# EAGLE schematic rgb circle (EAGLE 5.11)

## Sheet 1 of 2
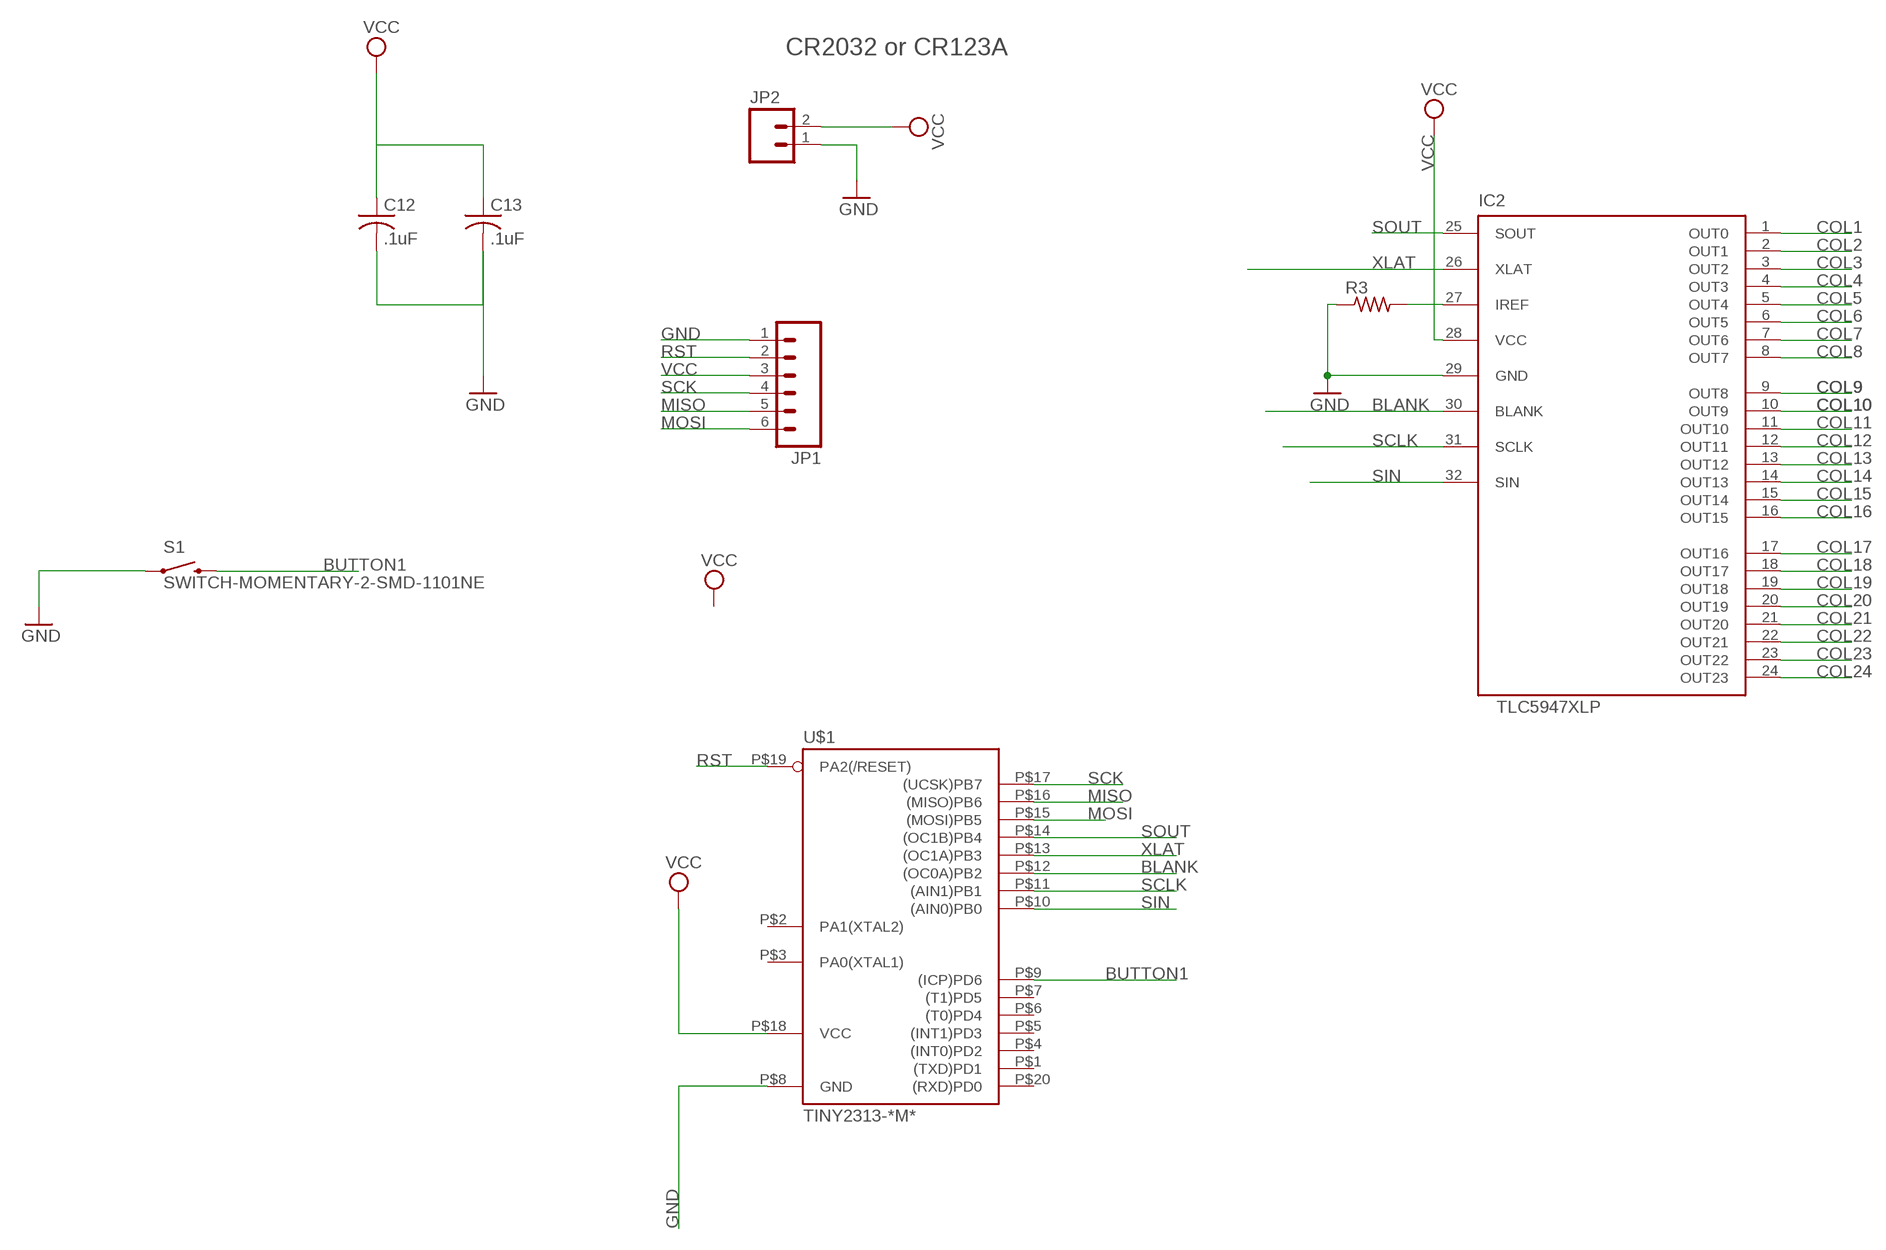
[diagram p0: schematic, sheet 1]

### Parts
C12  .1uF  C-USC0805  [C0805]
C13  .1uF  C-USC0805  [C0805]
IC2  TLC5947XLP  [QFN32_XLP]
JP1  M06SMD-FEMALE-V2  [1X06-SMD-FEMALE-V2]
JP2  M02PTH  [1X02]
R3  R-US_R0805  [R0805]
S1  SWITCH-MOMENTARY-2-SMD-1101NE  [TACTILE-SWITCH-1101NE]
U$1  TINY2313-*M*  [MLF20]

### Nets
BLANK: IC2.30(BLANK) U$1.P$12((OC0A)PB2)
BUTTON1: S1.P$2 U$1.P$9((ICP)PD6)
COL1: IC2.1(OUT0) ; also sheet 2
COL2: IC2.2(OUT1) ; also sheet 2
COL3: IC2.3(OUT2) ; also sheet 2
COL4: IC2.4(OUT3) ; also sheet 2
COL5: IC2.5(OUT4) ; also sheet 2
COL6: IC2.6(OUT5) ; also sheet 2
COL7: IC2.7(OUT6) ; also sheet 2
COL8: IC2.8(OUT7) ; also sheet 2
COL9: IC2.9(OUT8) ; also sheet 2
COL10: IC2.10(OUT9) ; also sheet 2
COL11: IC2.11(OUT10) ; also sheet 2
COL12: IC2.12(OUT11) ; also sheet 2
COL13: IC2.13(OUT12) ; also sheet 2
COL14: IC2.14(OUT13) ; also sheet 2
COL15: IC2.15(OUT14) ; also sheet 2
COL16: IC2.16(OUT15) ; also sheet 2
COL17: IC2.17(OUT16) ; also sheet 2
COL18: IC2.18(OUT17) ; also sheet 2
COL19: IC2.19(OUT18) ; also sheet 2
COL20: IC2.20(OUT19) ; also sheet 2
COL21: IC2.21(OUT20) ; also sheet 2
COL22: IC2.22(OUT21) ; also sheet 2
COL23: IC2.23(OUT22) ; also sheet 2
COL24: IC2.24(OUT23) ; also sheet 2
GND: C12.2 C13.2 IC2.29(GND) JP1.1 R3.1 S1.P$1 U$1.P$8(GND)
MISO: JP1.5 U$1.P$16((MISO)PB6)
MOSI: JP1.6 U$1.P$15((MOSI)PB5)
N$13: IC2.27(IREF) R3.2
RST: JP1.2 U$1.P$19(PA2(/RESET))
SCK: JP1.4 U$1.P$17((UCSK)PB7)
SCLK: IC2.31(SCLK) U$1.P$11((AIN1)PB1)
SIN: IC2.32(SIN) U$1.P$10((AIN0)PB0)
SOUT: IC2.25(SOUT) U$1.P$14((OC1B)PB4)
VCC: C12.1 C13.1 IC2.28(VCC) JP1.3 U$1.P$18(VCC) ; also sheet 2
XLAT: IC2.26(XLAT) U$1.P$13((OC1A)PB3)
Unconnected: JP2.1 JP2.2 U$1.P$1((TXD)PD1) U$1.P$2(PA1(XTAL2)) U$1.P$3(PA0(XTAL1)) U$1.P$4((INT0)PD2) U$1.P$5((INT1)PD3) U$1.P$6((T0)PD4) U$1.P$7((T1)PD5) U$1.P$20((RXD)PD0)

### Notes on the sheet
- CR2032 or CR123A

## Sheet 2 of 2
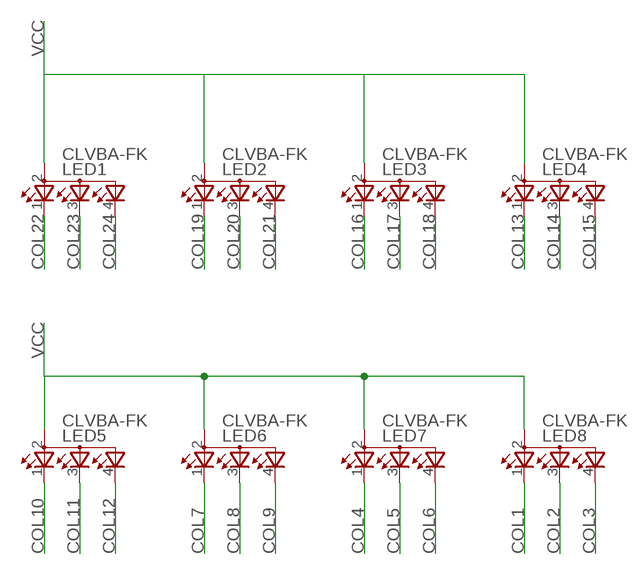
[diagram p1: schematic, sheet 2]

### Parts
LED1  CLVBA-FK  [PLCC4]
LED2  CLVBA-FK  [PLCC4]
LED3  CLVBA-FK  [PLCC4]
LED4  CLVBA-FK  [PLCC4]
LED5  CLVBA-FK  [PLCC4]
LED6  CLVBA-FK  [PLCC4]
LED7  CLVBA-FK  [PLCC4]
LED8  CLVBA-FK  [PLCC4]

### Nets
COL1: LED8.1(CRED) ; also sheet 1
COL2: LED8.3(CBLUE) ; also sheet 1
COL3: LED8.4(CGREEN) ; also sheet 1
COL4: LED7.1(CRED) ; also sheet 1
COL5: LED7.3(CBLUE) ; also sheet 1
COL6: LED7.4(CGREEN) ; also sheet 1
COL7: LED6.1(CRED) ; also sheet 1
COL8: LED6.3(CBLUE) ; also sheet 1
COL9: LED6.4(CGREEN) ; also sheet 1
COL10: LED5.1(CRED) ; also sheet 1
COL11: LED5.3(CBLUE) ; also sheet 1
COL12: LED5.4(CGREEN) ; also sheet 1
COL13: LED4.1(CRED) ; also sheet 1
COL14: LED4.3(CBLUE) ; also sheet 1
COL15: LED4.4(CGREEN) ; also sheet 1
COL16: LED3.1(CRED) ; also sheet 1
COL17: LED3.3(CBLUE) ; also sheet 1
COL18: LED3.4(CGREEN) ; also sheet 1
COL19: LED2.1(CRED) ; also sheet 1
COL20: LED2.3(CBLUE) ; also sheet 1
COL21: LED2.4(CGREEN) ; also sheet 1
COL22: LED1.1(CRED) ; also sheet 1
COL23: LED1.3(CBLUE) ; also sheet 1
COL24: LED1.4(CGREEN) ; also sheet 1
VCC: LED1.2(A2) LED2.2(A2) LED3.2(A2) LED4.2(A2) LED5.2(A2) LED6.2(A2) LED7.2(A2) LED8.2(A2) ; also sheet 1

## Library data of the parts
C12 C13 = rcl:C-US: CAPACITOR, American symbol
IC2 = slice_noshift:TLC5947
JP1 = 8x8:M06
JP2 = SparkFun:M02: Header 2 Standard 2-pin 0.1" header. Use with straight break away headers (SKU : PRT-00116), right angle break away headers (PRT-00553), swiss pins (PRT-00743), machine pins (PRT-00117), and female headers (PRT-00115). Molex polarized connector foot print use with SKU : PRT-08233 with associated crimp pins and housings.
LED1-LED8 = rf_blinky:CLVBA-FK
R3 = rcl:R-US_: RESISTOR, American symbol
S1 = CPLD_Class:SWITCH-MOMENTARY-2
U$1 = NSL_Cylon:TINY2313*: Atmel Tiny2313 2K Flash, 128 bytes EEPROM, 128 bytes RAM